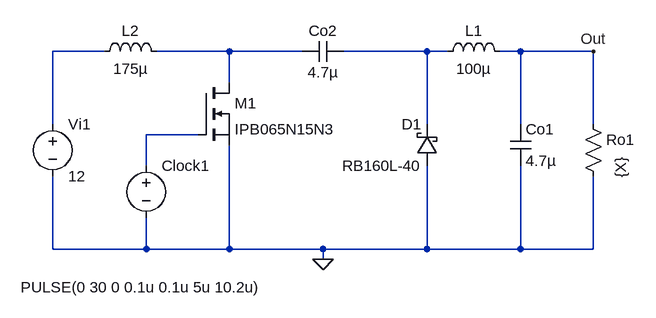
[diagram p0: schematic cuk.asc]
cuk.asc, the LTspice schematic file:
Version 4.1
SHEET 1 880 680
WIRE -208 64 -288 64
WIRE -16 64 -128 64
WIRE 96 64 -16 64
WIRE 288 64 160 64
WIRE 320 64 288 64
WIRE 432 64 400 64
WIRE 544 64 432 64
WIRE -16 112 -16 64
WIRE -288 176 -288 64
WIRE 288 176 288 64
WIRE 432 176 432 64
WIRE 544 176 544 64
WIRE -64 192 -144 192
WIRE -144 240 -144 192
WIRE -288 368 -288 256
WIRE -144 368 -144 320
WIRE -144 368 -288 368
WIRE -16 368 -16 208
WIRE -16 368 -144 368
WIRE 128 368 -16 368
WIRE 288 368 288 240
WIRE 288 368 128 368
WIRE 432 368 432 240
WIRE 432 368 288 368
WIRE 544 368 544 256
WIRE 544 368 432 368
WIRE 128 384 128 368
FLAG 128 384 0
FLAG 544 64 Out
SYMBOL nmos -64 112 R0
SYMATTR InstName M1
SYMATTR Value IPB065N15N3
SYMBOL ind 304 80 R270
WINDOW 0 32 56 VTop 2
WINDOW 3 5 56 VBottom 2
SYMATTR InstName L1
SYMATTR Value 100µ
SYMBOL schottky 304 240 R180
WINDOW 0 24 64 Left 2
WINDOW 3 24 0 Left 2
SYMATTR InstName D1
SYMATTR Value RB160L-40
SYMATTR Description Diode
SYMATTR Type diode
SYMBOL cap 416 176 R0
SYMATTR InstName Co1
SYMATTR Value 4.7µ
SYMBOL res 528 160 R0
WINDOW 3 58 99 VLeft 2
SYMATTR Value {X}
SYMATTR InstName Ro1
SYMBOL voltage -144 224 R0
WINDOW 123 0 0 Left 2
WINDOW 39 0 0 Left 2
WINDOW 3 -193 203 Left 2
SYMATTR InstName Clock1
SYMATTR Value PULSE(0 30 0 0.1u 0.1u 5u 10.2u)
SYMBOL voltage -288 160 R0
WINDOW 123 0 0 Left 2
WINDOW 39 0 0 Left 2
SYMATTR InstName Vi1
SYMATTR Value 12
SYMBOL ind -224 80 R270
WINDOW 0 32 56 VTop 2
WINDOW 3 5 56 VBottom 2
SYMATTR InstName L2
SYMATTR Value 175µ
SYMBOL cap 160 48 R90
WINDOW 0 0 32 VBottom 2
WINDOW 3 32 32 VTop 2
SYMATTR InstName Co2
SYMATTR Value 4.7µ

The netlist it stands for:
* cuk.asc
M1 N002 N004 0 0 IPB065N15N3
L1 N003 Out 100µ
D1 0 N003 RB160L-40
Co1 Out 0 4.7µ
Ro1 Out 0 {X}
V§Clock1 N004 0 PULSE(0 30 0 0.1u 0.1u 5u 10.2u)
Vi1 N001 0 12
L2 N001 N002 175µ
Co2 N003 N002 4.7µ
.model D D
.lib standard.dio
.model NMOS NMOS
.model PMOS PMOS
.lib standard.mos
.backanno
.end